# Altium schematic sheet PAGE1.SchDoc: UMCA
size 420 x 297 mm; Page Create Date: March  8, 1995; Page Number: 1; Page Size: A; Comment: TitleBlock0; Page Count: 1; RevCode: A; Doc: 0.1; DsnPath: D:\Projects\ProjectScience\electronics\ProjectID_DOSTI_STLINK\STLINK.DSN; SchematicName: SCHEMATIC1; PageName: PAGE1; PageSize: A3; TopSchematic: True
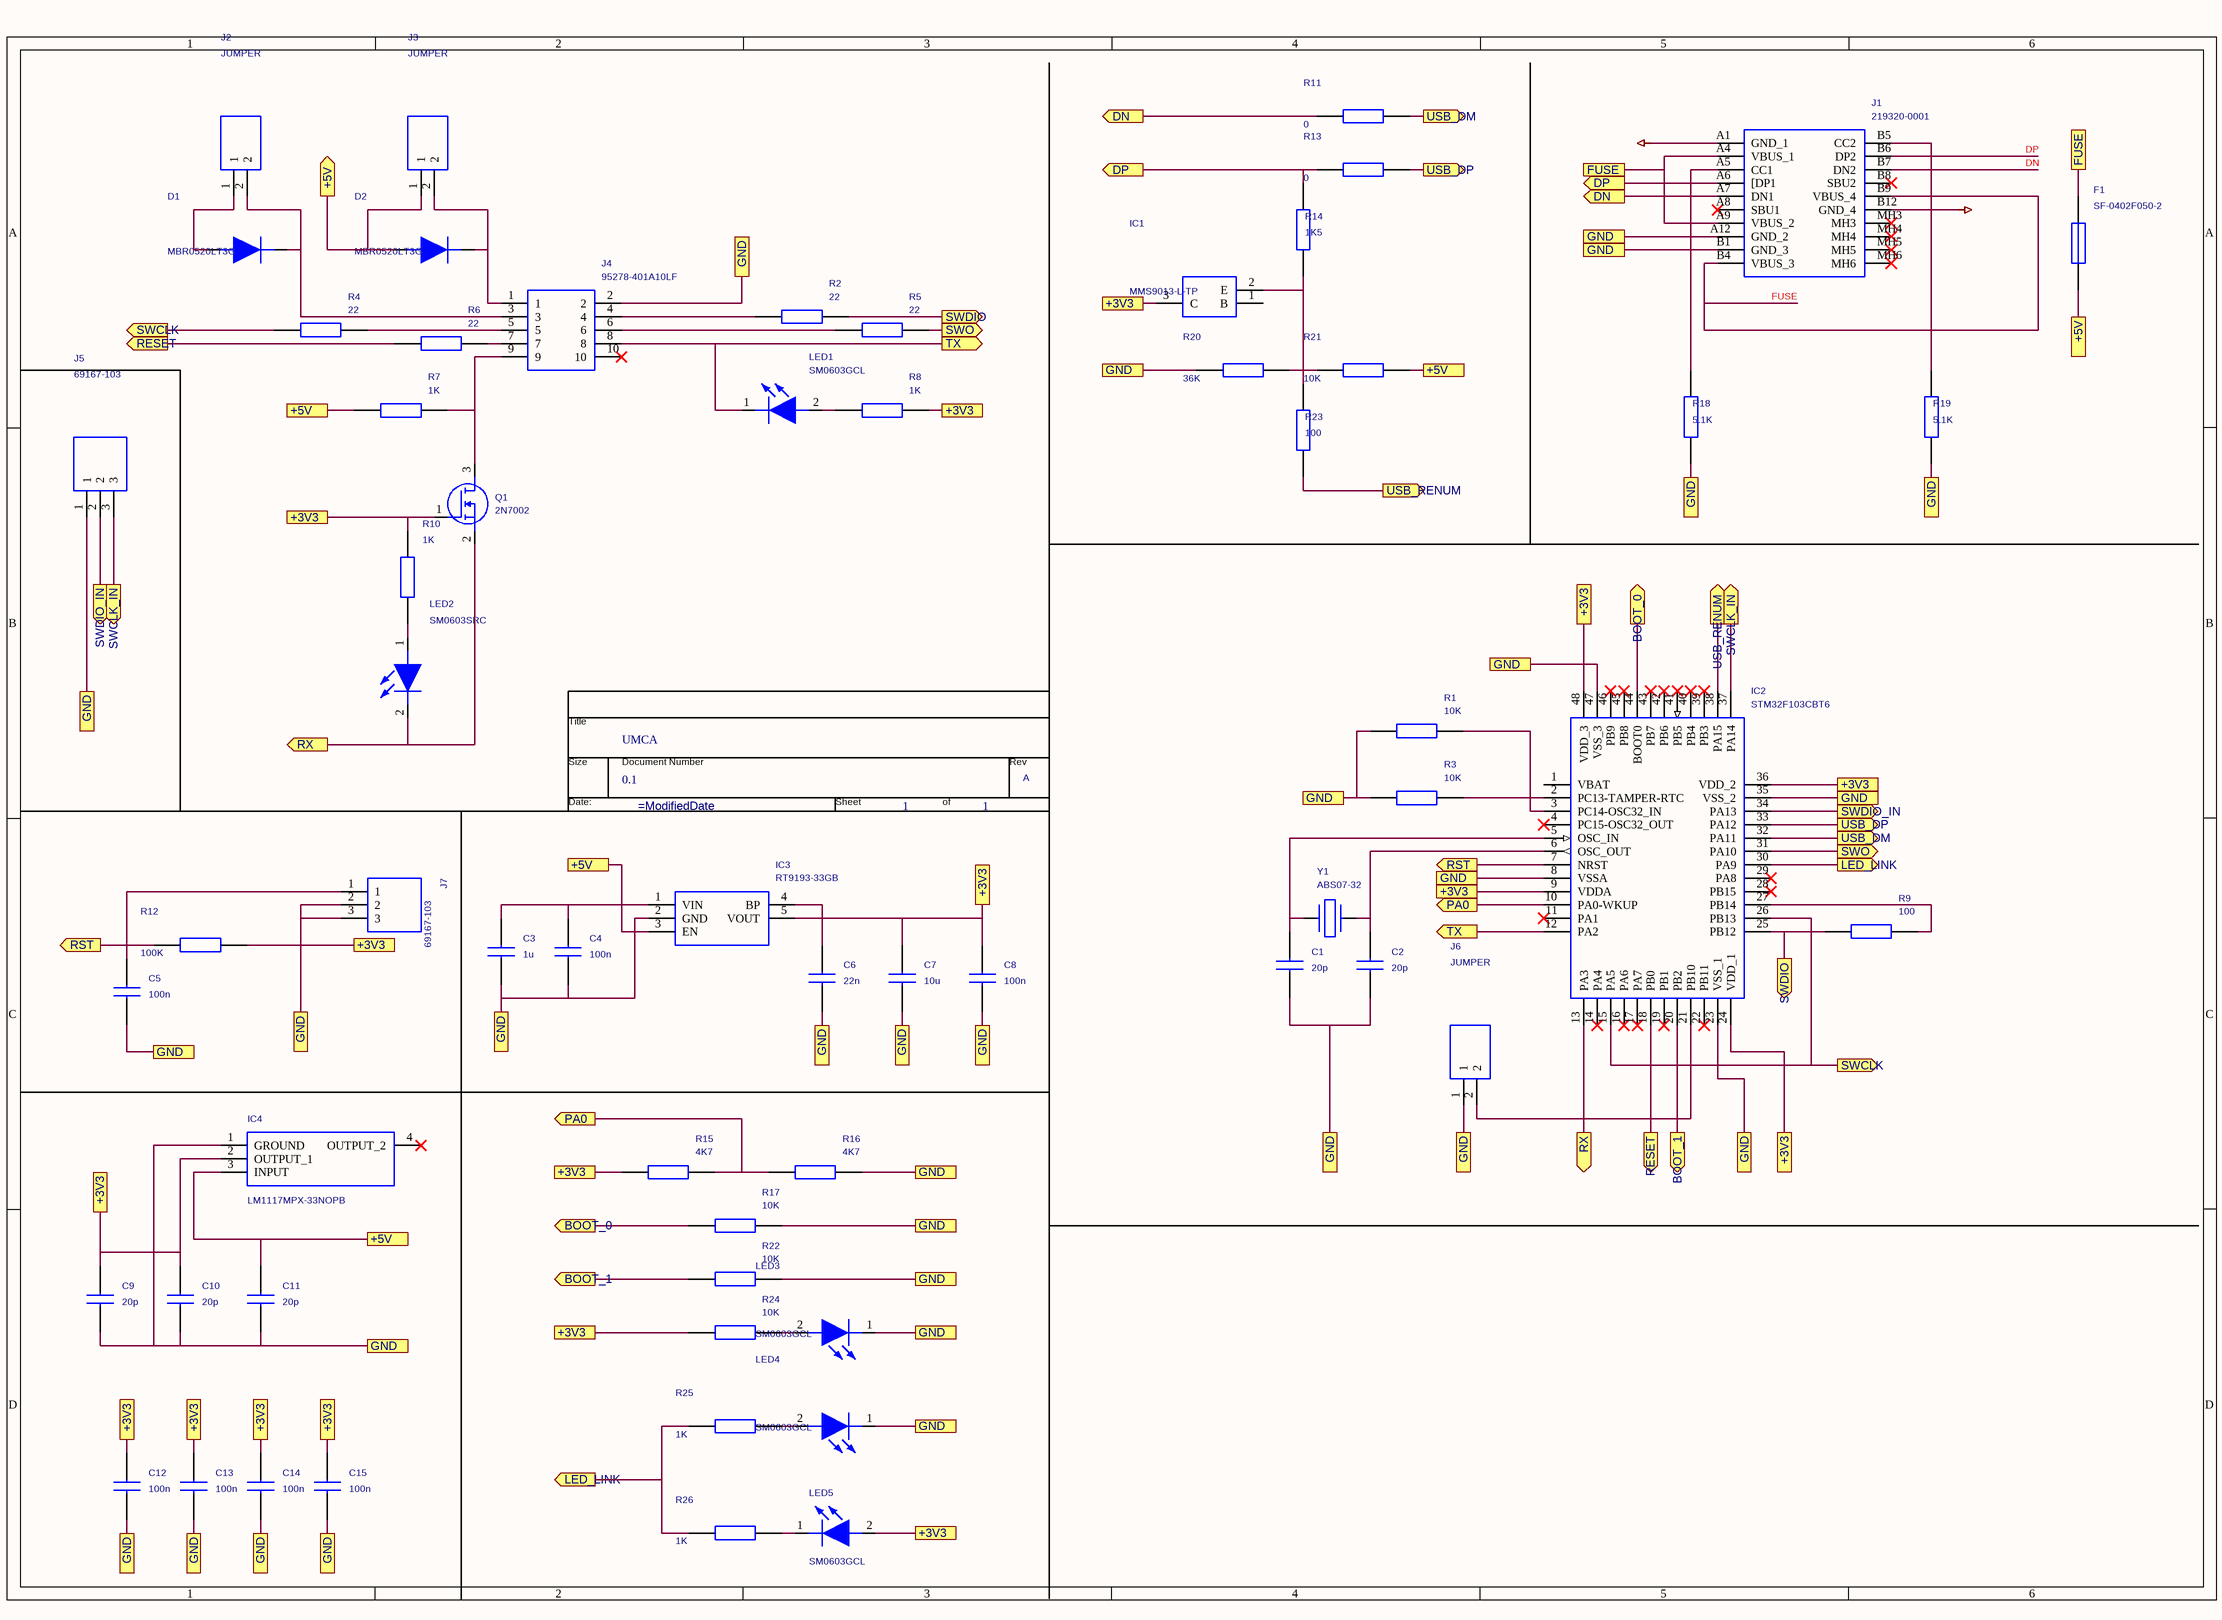
[diagram p0: PAGE1.SchDoc]

## Parts
*  Doc: 0.1  RevCode: A  Title: UMCA  Page Number: 1  (hidden comment: TitleBlock0)  (graphical)
C1  20p  [CAPC0603X33N]
C2  20p  [CAPC0603X33N]
C3  1u  [CAPC0603X33N]
C4  100n  [CAPC0603X33N]
C5  100n  [CAPC0603X33N]
C6  22n  [CAPC0603X33N]
C7  10u  [CAPC0603X33N]
C8  100n  [CAPC0603X33N]
C9  20p  [CAPC0603X33N]
C10  20p  [CAPC0603X33N]
C11  20p  [CAPC0603X33N]
C12  100n  [CAPC0603X33N]
C13  100n  [CAPC0603X33N]
C14  100n  [CAPC0603X33N]
C15  100n  [CAPC0603X33N]
D1  MBR0520LT3G  [SOD3716X135N]
D2  MBR0520LT3G  [SOD3716X135N]
F1  SF-0402F050-2  [FUSC1005X40N]
IC1  MMS9013-L-TP  [SOT95P237X125-3N]
IC2  STM32F103CBT6  [QFP50P900X900X160-48N]
IC3  RT9193-33GB  [SOT94P279X130-5N]
IC4  LM1117MPX-33NOPB  [SOT230P700X180-4N]
J1  219320-0001  [2193200001]
J2  JUMPER  [HDRV2W67P254_2X1_254X483X858P]
J3  JUMPER  [HDRV2W67P254_2X1_254X483X858P]
J4  95278-401A10LF  [95278401A10LF]
J5  69167-103  [SHDR3W64P0X254_1X3_762X516X980P]
J6  JUMPER  [HDRV2W67P254_2X1_254X483X858P]
J7  69167-103  [SHDR3W64P0X254_1X3_762X516X980P]
LED1  SM0603GCL  [LEDC1608X60N]
LED2  SM0603SRC  [SM0603SRC]
LED3  SM0603GCL  [LEDC1608X60N]
LED4  SM0603GCL  [LEDC1608X60N]
LED5  SM0603GCL  [LEDC1608X60N]
Q1  2N7002  [SOT96P240X120-3N]
R1  10K  [RESC1608X55N]
R2  22  [RESC1608X55N]
R3  10K  [RESC1608X55N]
R4  22  [RESC1608X55N]
R5  22  [RESC1608X55N]
R6  22  [RESC1608X55N]
R7  1K  [RESC1608X55N]
R8  1K  [RESC1608X55N]
R9  100  [RESC1608X55N]
R10  1K  [RESC1608X55N]
R11  0  [RESC1608X55N]
R12  100K  [RESC1608X55N]
R13  0  [RESC1608X55N]
R14  1K5  [RESC1608X55N]
R15  4K7  [RESC1608X55N]
R16  4K7  [RESC1608X55N]
R17  10K  [RESC1608X55N]
R18  5.1K  [RESC1608X55N]
R19  5.1K  [RESC1608X55N]
R20  36K  [RESC1608X55N]
R21  10K  [RESC1608X55N]
R22  10K  [RESC1608X55N]
R23  100  [RESC1608X55N]
R24  10K  [RESC1608X55N]
R25  1K  [RESC1608X55N]
R26  1K  [RESC1608X55N]
Y1  ABS07-32  [ABS07]

## Ports
+3V3, +5V, +5V (out), BOOT_0 (out), BOOT_1 (out), DN (out), DP (out), FUSE, GND, LED_LINK (out), PA0 (out), RESET (out), RST (out), RX (out), SWCLK (out), SWCLK_IN (out), SWDIO (out), SWDIO_IN (out), SWO (out), TX (out), USB_DM (out), USB_DP (out), USB_RENUM (out)

## Nets
0: J1.A1(GND_1) J1.B12(GND_4)
+3V3: C7.2 C8.2 C9.2 C10.2 C12.2 C13.2 C14.2 C15.2 IC1.3(C) IC2.9(VDDA) IC2.24(VDD_1) IC2.36(VDD_2) IC2.48(VDD_3) IC3.5(VOUT) IC4.2(OUTPUT_1) LED5.2(A) Q1.1(G) R8.2 R10.2 R12.1 R15.1 R24.1 ; port +3V3
+5V: C11.2 D2.2(A) F1.1 IC3.3(EN) IC4.3(INPUT) J3.1 R7.1 R21.1 ; port +5V
BOOT_0: IC2.44(BOOT0) R17.1 ; port BOOT_0
BOOT_1: IC2.20(PB2) R22.1 ; port BOOT_1
DN: J1.A7(DN1) R11.2 ; port DN
DN: J1.B7(DN2)  [a separate net that carries the same name]
DP: J1.A6([DP1) R13.2 R14.1 ; port DP
DP: J1.B6(DP2)  [a separate net that carries the same name]
FUSE: F1.2 J1.A4(VBUS_1) J1.A9(VBUS_2) ; port FUSE
FUSE: J1.B4(VBUS_3) J1.B9(VBUS_4)  [a separate net that carries the same name]
GND: C1.1 C2.1 C3.1 C4.1 C5.1 C6.1 C7.1 C8.1 C9.1 C10.1 C11.1 C12.1 C13.1 C14.1 C15.1 IC2.8(VSSA) IC2.23(VSS_1) IC2.35(VSS_2) IC2.47(VSS_3) IC3.2(GND) IC4.1(GROUND) J1.A12(GND_2) J1.B1(GND_3) J4.2 J5.1 J6.1 J7.2 J7.3 LED3.1(K) LED4.1(K) R1.1 R3.1 R16.2 R17.2 R18.2 R19.2 R20.2 R22.2 ; port GND
LED_LINK: IC2.30(PA9) R25.2 R26.2 ; port LED_LINK
PA0: IC2.10(PA0-WKUP) R15.2 R16.1 ; port PA0
RESET: IC2.18(PB0) R6.1 ; port RESET
RST: C5.2 IC2.7(NRST) J7.1 R12.2 ; port RST
RX: IC2.13(PA3) LED2.2(K) Q1.2(S) ; port RX
SWCLK: IC2.15(PA5) IC2.26(PB13) R4.1 ; port SWCLK
SWCLK_IN: IC2.37(PA14) J5.3 ; port SWCLK_IN
SWDIO: IC2.25(PB12) R2.2 R9.1 ; port SWDIO
SWDIO_IN: IC2.34(PA13) J5.2 ; port SWDIO_IN
SWO: IC2.31(PA10) R5.2 ; port SWO
TX: IC2.12(PA2) J4.8 LED1.1(K) ; port TX
USB_DM: IC2.32(PA11) R11.1 ; port USB_DM
USB_DP: IC2.33(PA12) R13.1 ; port USB_DP
USB_RENUM: IC2.38(PA15) R23.2 ; port USB_RENUM
NetC1_2: C1.2 IC2.5(OSC_IN) Y1.1
NetC2_2: C2.2 IC2.6(OSC_OUT) Y1.2
NetC3_2: C3.2 C4.2 IC3.1(VIN)
NetC6_2: C6.2 IC3.4(BP)
NetD1_1: D1.1(K) J2.2 J4.3
NetD1_2: D1.2(A) J2.1
NetD2_1: D2.1(K) J3.2 J4.1
NetIC1_2: IC1.2(E) R14.2 R20.1 R21.2 R23.1
NetIC2_2: IC2.2(PC13-TAMPER-RTC) R3.2
NetIC2_3: IC2.3(PC14-OSC32_IN) R1.2
NetIC2_21: IC2.21(PB10) J6.2
NetIC2_27: IC2.27(PB14) R9.2
NetJ1_A5: J1.A5(CC1) R18.1
NetJ1_B5: J1.B5(CC2) R19.1
NetJ4_4: J4.4 R2.1
NetJ4_5: J4.5 R4.2
NetJ4_6: J4.6 R5.1
NetJ4_7: J4.7 R6.2
NetJ4_9: J4.9 Q1.3(D) R7.2
NetLED1_2: LED1.2(A) R8.1
NetLED2_1: LED2.1(A) R10.1
NetLED3_2: LED3.2(A) R24.2
NetLED4_2: LED4.2(A) R25.1
NetLED5_1: LED5.1(K) R26.1

Not connected (* = marked no-connect by the designer): IC1 1(B); IC2 1(VBAT) 4(PC15-OSC32_OUT)* 11(PA1)* 14(PA4)* 16(PA6)* 17(PA7)* 19(PB1)* 22(PB11)* 28(PB15)* 29(PA8)* 39(PB3)* 40(PB4)* 41(PB5)* 42(PB6)* 43(PB7)* 45(PB8)* 46(PB9)*; IC4 4(OUTPUT_2)*; J1 A8(SBU1)* B8(SBU2)* MH3* MH4* MH5* MH6*; J4 10*

## Notes on the sheet
- (in symbol TitleBlock0) Title; Size; Document Number; Rev; Date:; Sheet; of

## Library data of the parts
C1 = GRM033D70E105ME15D: Capacitor GRM03_0.09 L=0.6mm W=0.3mm T=0.3mm; Manufacturer_Name: Murata Electronics; Part Reference: C1; Height: 0.33 mm; Datasheet Link: http://www.murata.com/~/media/webrenewal/support/library/catalog/products/capacitor/mlcc/c02e.pdf; Manufacturer_Part_Number: GRM033D70E105ME15D; Mouser Price/Stock: https://www.mouser.co.uk/ProductDetail/Murata-Electronics/GRM033D70E105ME15D?qs=r5DSvlrkXmLLNF3ZiIF79w%3D%3D; Mouser Part Number: 81-GRM033D70E105ME5D; Value: 20p; PCB Footprint: CAPC0603X33N
C2 = GRM033D70E105ME15D: Capacitor GRM03_0.09 L=0.6mm W=0.3mm T=0.3mm; Manufacturer_Name: Murata Electronics; Part Reference: C2; Height: 0.33 mm; Datasheet Link: http://www.murata.com/~/media/webrenewal/support/library/catalog/products/capacitor/mlcc/c02e.pdf; Manufacturer_Part_Number: GRM033D70E105ME15D; Mouser Price/Stock: https://www.mouser.co.uk/ProductDetail/Murata-Electronics/GRM033D70E105ME15D?qs=r5DSvlrkXmLLNF3ZiIF79w%3D%3D; Mouser Part Number: 81-GRM033D70E105ME5D; Value: 20p; PCB Footprint: CAPC0603X33N
C3 = GRM033D70E105ME15D: Capacitor GRM03_0.09 L=0.6mm W=0.3mm T=0.3mm; Manufacturer_Name: Murata Electronics; Part Reference: C3; Height: 0.33 mm; Datasheet Link: http://www.murata.com/~/media/webrenewal/support/library/catalog/products/capacitor/mlcc/c02e.pdf; Manufacturer_Part_Number: GRM033D70E105ME15D; Mouser Price/Stock: https://www.mouser.co.uk/ProductDetail/Murata-Electronics/GRM033D70E105ME15D?qs=r5DSvlrkXmLLNF3ZiIF79w%3D%3D; Mouser Part Number: 81-GRM033D70E105ME5D; Value: 1u; PCB Footprint: CAPC0603X33N
C4 = GRM033D70E105ME15D: Capacitor GRM03_0.09 L=0.6mm W=0.3mm T=0.3mm; Manufacturer_Name: Murata Electronics; Part Reference: C4; Height: 0.33 mm; Datasheet Link: http://www.murata.com/~/media/webrenewal/support/library/catalog/products/capacitor/mlcc/c02e.pdf; Manufacturer_Part_Number: GRM033D70E105ME15D; Mouser Price/Stock: https://www.mouser.co.uk/ProductDetail/Murata-Electronics/GRM033D70E105ME15D?qs=r5DSvlrkXmLLNF3ZiIF79w%3D%3D; Mouser Part Number: 81-GRM033D70E105ME5D; Value: 100n; PCB Footprint: CAPC0603X33N
C5 = GRM033D70E105ME15D: Capacitor GRM03_0.09 L=0.6mm W=0.3mm T=0.3mm; Manufacturer_Name: Murata Electronics; Part Reference: C5; Height: 0.33 mm; Datasheet Link: http://www.murata.com/~/media/webrenewal/support/library/catalog/products/capacitor/mlcc/c02e.pdf; Manufacturer_Part_Number: GRM033D70E105ME15D; Mouser Price/Stock: https://www.mouser.co.uk/ProductDetail/Murata-Electronics/GRM033D70E105ME15D?qs=r5DSvlrkXmLLNF3ZiIF79w%3D%3D; Mouser Part Number: 81-GRM033D70E105ME5D; Value: 100n; PCB Footprint: CAPC0603X33N
C6 = GRM033D70E105ME15D: Capacitor GRM03_0.09 L=0.6mm W=0.3mm T=0.3mm; Manufacturer_Name: Murata Electronics; Part Reference: C6; Height: 0.33 mm; Datasheet Link: http://www.murata.com/~/media/webrenewal/support/library/catalog/products/capacitor/mlcc/c02e.pdf; Manufacturer_Part_Number: GRM033D70E105ME15D; Mouser Price/Stock: https://www.mouser.co.uk/ProductDetail/Murata-Electronics/GRM033D70E105ME15D?qs=r5DSvlrkXmLLNF3ZiIF79w%3D%3D; Mouser Part Number: 81-GRM033D70E105ME5D; Value: 22n; PCB Footprint: CAPC0603X33N
C7 = GRM033D70E105ME15D: Capacitor GRM03_0.09 L=0.6mm W=0.3mm T=0.3mm; Manufacturer_Name: Murata Electronics; Part Reference: C7; Height: 0.33 mm; Datasheet Link: http://www.murata.com/~/media/webrenewal/support/library/catalog/products/capacitor/mlcc/c02e.pdf; Manufacturer_Part_Number: GRM033D70E105ME15D; Mouser Price/Stock: https://www.mouser.co.uk/ProductDetail/Murata-Electronics/GRM033D70E105ME15D?qs=r5DSvlrkXmLLNF3ZiIF79w%3D%3D; Mouser Part Number: 81-GRM033D70E105ME5D; Value: 10u; PCB Footprint: CAPC0603X33N
C8 = GRM033D70E105ME15D: Capacitor GRM03_0.09 L=0.6mm W=0.3mm T=0.3mm; Manufacturer_Name: Murata Electronics; Part Reference: C8; Height: 0.33 mm; Datasheet Link: http://www.murata.com/~/media/webrenewal/support/library/catalog/products/capacitor/mlcc/c02e.pdf; Manufacturer_Part_Number: GRM033D70E105ME15D; Mouser Price/Stock: https://www.mouser.co.uk/ProductDetail/Murata-Electronics/GRM033D70E105ME15D?qs=r5DSvlrkXmLLNF3ZiIF79w%3D%3D; Mouser Part Number: 81-GRM033D70E105ME5D; Value: 100n; PCB Footprint: CAPC0603X33N
C9 = GRM033D70E105ME15D: Capacitor GRM03_0.09 L=0.6mm W=0.3mm T=0.3mm; Manufacturer_Name: Murata Electronics; Part Reference: C9; Height: 0.33 mm; Datasheet Link: http://www.murata.com/~/media/webrenewal/support/library/catalog/products/capacitor/mlcc/c02e.pdf; Manufacturer_Part_Number: GRM033D70E105ME15D; Mouser Price/Stock: https://www.mouser.co.uk/ProductDetail/Murata-Electronics/GRM033D70E105ME15D?qs=r5DSvlrkXmLLNF3ZiIF79w%3D%3D; Mouser Part Number: 81-GRM033D70E105ME5D; Value: 20p; PCB Footprint: CAPC0603X33N
C10 = GRM033D70E105ME15D: Capacitor GRM03_0.09 L=0.6mm W=0.3mm T=0.3mm; Manufacturer_Name: Murata Electronics; Part Reference: C10; Height: 0.33 mm; Datasheet Link: http://www.murata.com/~/media/webrenewal/support/library/catalog/products/capacitor/mlcc/c02e.pdf; Manufacturer_Part_Number: GRM033D70E105ME15D; Mouser Price/Stock: https://www.mouser.co.uk/ProductDetail/Murata-Electronics/GRM033D70E105ME15D?qs=r5DSvlrkXmLLNF3ZiIF79w%3D%3D; Mouser Part Number: 81-GRM033D70E105ME5D; Value: 20p; PCB Footprint: CAPC0603X33N
C11 = GRM033D70E105ME15D: Capacitor GRM03_0.09 L=0.6mm W=0.3mm T=0.3mm; Manufacturer_Name: Murata Electronics; Part Reference: C11; Height: 0.33 mm; Datasheet Link: http://www.murata.com/~/media/webrenewal/support/library/catalog/products/capacitor/mlcc/c02e.pdf; Manufacturer_Part_Number: GRM033D70E105ME15D; Mouser Price/Stock: https://www.mouser.co.uk/ProductDetail/Murata-Electronics/GRM033D70E105ME15D?qs=r5DSvlrkXmLLNF3ZiIF79w%3D%3D; Mouser Part Number: 81-GRM033D70E105ME5D; Value: 20p; PCB Footprint: CAPC0603X33N
C12 = GRM033D70E105ME15D: Capacitor GRM03_0.09 L=0.6mm W=0.3mm T=0.3mm; Manufacturer_Name: Murata Electronics; Part Reference: C12; Height: 0.33 mm; Datasheet Link: http://www.murata.com/~/media/webrenewal/support/library/catalog/products/capacitor/mlcc/c02e.pdf; Manufacturer_Part_Number: GRM033D70E105ME15D; Mouser Price/Stock: https://www.mouser.co.uk/ProductDetail/Murata-Electronics/GRM033D70E105ME15D?qs=r5DSvlrkXmLLNF3ZiIF79w%3D%3D; Mouser Part Number: 81-GRM033D70E105ME5D; Value: 100n; PCB Footprint: CAPC0603X33N
C13 = GRM033D70E105ME15D: Capacitor GRM03_0.09 L=0.6mm W=0.3mm T=0.3mm; Manufacturer_Name: Murata Electronics; Part Reference: C13; Height: 0.33 mm; Datasheet Link: http://www.murata.com/~/media/webrenewal/support/library/catalog/products/capacitor/mlcc/c02e.pdf; Manufacturer_Part_Number: GRM033D70E105ME15D; Mouser Price/Stock: https://www.mouser.co.uk/ProductDetail/Murata-Electronics/GRM033D70E105ME15D?qs=r5DSvlrkXmLLNF3ZiIF79w%3D%3D; Mouser Part Number: 81-GRM033D70E105ME5D; Value: 100n; PCB Footprint: CAPC0603X33N
C14 = GRM033D70E105ME15D: Capacitor GRM03_0.09 L=0.6mm W=0.3mm T=0.3mm; Manufacturer_Name: Murata Electronics; Part Reference: C14; Height: 0.33 mm; Datasheet Link: http://www.murata.com/~/media/webrenewal/support/library/catalog/products/capacitor/mlcc/c02e.pdf; Manufacturer_Part_Number: GRM033D70E105ME15D; Mouser Price/Stock: https://www.mouser.co.uk/ProductDetail/Murata-Electronics/GRM033D70E105ME15D?qs=r5DSvlrkXmLLNF3ZiIF79w%3D%3D; Mouser Part Number: 81-GRM033D70E105ME5D; Value: 100n; PCB Footprint: CAPC0603X33N
C15 = GRM033D70E105ME15D: Capacitor GRM03_0.09 L=0.6mm W=0.3mm T=0.3mm; Manufacturer_Name: Murata Electronics; Part Reference: C15; Height: 0.33 mm; Datasheet Link: http://www.murata.com/~/media/webrenewal/support/library/catalog/products/capacitor/mlcc/c02e.pdf; Manufacturer_Part_Number: GRM033D70E105ME15D; Mouser Price/Stock: https://www.mouser.co.uk/ProductDetail/Murata-Electronics/GRM033D70E105ME15D?qs=r5DSvlrkXmLLNF3ZiIF79w%3D%3D; Mouser Part Number: 81-GRM033D70E105ME5D; Value: 100n; PCB Footprint: CAPC0603X33N
D1 = MBR0520LT3G: ON SEMICONDUCTOR - MBR0520LT3G - RECTIFIER, SCHOTTKY, 0.5A, 20V, SOD-123; Manufacturer_Name: onsemi; Part Reference: D1; Height: 1.35 mm; Datasheet Link: http://www.onsemi.com/pub/Collateral/MBR0520LT1-D.PDF; Manufacturer_Part_Number: MBR0520LT3G; Mouser Price/Stock: https://www.mouser.co.uk/ProductDetail/onsemi/MBR0520LT3G?qs=3JMERSakebrHITezQJBmeQ%3D%3D; Mouser Part Number: 863-MBR0520LT3G; Value: MBR0520LT3G; PCB Footprint: SOD3716X135N
D2 = MBR0520LT3G: ON SEMICONDUCTOR - MBR0520LT3G - RECTIFIER, SCHOTTKY, 0.5A, 20V, SOD-123; Manufacturer_Name: onsemi; Part Reference: D2; Height: 1.35 mm; Datasheet Link: http://www.onsemi.com/pub/Collateral/MBR0520LT1-D.PDF; Manufacturer_Part_Number: MBR0520LT3G; Mouser Price/Stock: https://www.mouser.co.uk/ProductDetail/onsemi/MBR0520LT3G?qs=3JMERSakebrHITezQJBmeQ%3D%3D; Mouser Part Number: 863-MBR0520LT3G; Value: MBR0520LT3G; PCB Footprint: SOD3716X135N
F1 = SF-0402F050-2: Fuse Chip Fast Acting 0.5A 24V SMD Solder Pad 0402 T/R UL; Manufacturer_Name: Bourns; Part Reference: F1; Height: 0.4 mm; Datasheet Link: https://datasheet.datasheetarchive.com/originals/distributors/Datasheets-DGA13/1256866.pdf; Manufacturer_Part_Number: SF-0402F050-2; Mouser Price/Stock: https://www.mouser.co.uk/ProductDetail/Bourns/SF-0402F050-2?qs=GIQXYiEeHGDsZgBRav%2Fjqg%3D%3D; Mouser Part Number: 652-SF-0402F050-2; Value: SF-0402F050-2; PCB Footprint: FUSC1005X40N
IC1 = MMS9013-L-TP: Small Signal Bipolar Transistors; Manufacturer_Name: MCC; Part Reference: IC1; Height: 1.25 mm; Datasheet Link: https://mccsemi.com/pdf/Products/MMS9013(SOT-23).pdf; Manufacturer_Part_Number: MMS9013-L-TP; Mouser Price/Stock: https://www.mouser.co.uk/ProductDetail/Micro-Commercial-Components-MCC/MMS9013-L-TP?qs=P1JMDcb91o6OmgJiBYj6kQ%3D%3D; Mouser Part Number: 833-MMS9013L-TP; Value: MMS9013-L-TP; PCB Footprint: SOT95P237X125-3N
IC2 = STM32F103CBT6: STM32F103CBT6, 32 bit ARM Cortex M3 , 72MHz, 128 kB ROM , 20 kB RAM USB CAN I2C, 48 LQFP; Manufacturer_Name: STMicroelectronics; Part Reference: IC2; VDD_MIN: -0.3; VDD_MAX: 4; ICC: 150m; IOUT_MIN: 25m; RJA: 55; SUBTYPE: MCU SMD; POWER: 363m; TJ: 150; TECHNOLOGY: CMOS_TTL; IOUT_MAX: 25m; PACKAGE: LQFP-48; Height: 1.6 mm; Datasheet Link: http://www.st.com/st-web-ui/static/active/en/resource/technical/document/datasheet/CD00161566.pdf; Manufacturer_Part_Number: STM32F103CBT6; Mouser Price/Stock: https://www.mouser.co.uk/ProductDetail/STMicroelectronics/STM32F103CBT6?qs=WxFF5lh7QM3goh6GV5Ogig%3D%3D; Mouser Part Number: 511-STM32F103CBT6; Value: STM32F103CBT6; PCB Footprint: QFP50P900X900X160-48N
IC3 = RT9193-33GB: 300mA, Ultra-Low Noise, Ultra-Fast CMOS LDO Regulator; Manufacturer_Name: RICHTEK; Part Reference: IC3; Height: 1.295 mm; Datasheet Link: http://www.richtek.com/assets/product_file/RT9193/DS9193-17.pdf; Manufacturer_Part_Number: RT9193-33GB; Mouser Price/Stock: https://www.mouser.co.uk/ProductDetail/Richtek/RT9193-33GB?qs=amGC7iS6iy8ybRcZ9Wn2ww%3D%3D; Mouser Part Number: 835-RT9193-33GB; Value: RT9193-33GB; PCB Footprint: SOT94P279X130-5N
IC4 = LM1117MPX-33NOPB: LDO Voltage Regulators 800-mA 15-V linear voltage regulator 800-mA 15-V linear voltage regulator; Manufacturer_Name: onsemi; Part Reference: IC4; Height: 1.8 mm; Datasheet Link: https://www.arrow.com/en/products/lm1117mpx-33nopb/on-semiconductor; Manufacturer_Part_Number: LM1117MPX-33NOPB; Mouser Price/Stock: https://www.mouser.co.uk/ProductDetail/onsemi/LM1117MPX-33NOPB?qs=DPoM0jnrROUIbzbQHFmeig%3D%3D; Mouser Part Number: 863-LM1117MPX-33NOPB; Value: LM1117MPX-33NOPB; PCB Footprint: SOT230P700X180-4N
J1 = 219320-0001: Universal Serial Bus (USB) Shielded I/O Receptacle, Type C, Vertical, Surface Mount, Height 8.8mm, 16 Circuits, Gold (Au) Flash Plating; Manufacturer_Name: Molex; Part Reference: J1; Height: 9.05 mm; Datasheet Link: https://www.molex.com/content/dam/molex/molex-dot-com/products/automated/en-us/salesdrawingpdf/219/219320/2193200001_sd.pdf?inline; Manufacturer_Part_Number: 219320-0001; Mouser Price/Stock: https://www.mouser.co.uk/ProductDetail/Molex/219320-0001?qs=rQFj71Wb1eXha8qVBIXu3A%3D%3D; Mouser Part Number: 538-219320-0001; Value: 219320-0001; PCB Footprint: 2193200001
J2 = 67996-100HLF: BergStik<sup>&reg;</sup>, Board to Board connector, Unshrouded vertical header, Through Hole, Double Row, 0 Positions, 2.54 mm (0.100in) Pitch; Manufacturer_Name: Amphenol Communications Solutions; Part Reference: J2; Height: 8.58 mm; Datasheet Link: https://cdn.amphenol-cs.com/media/wysiwyg/files/drawing/67996.pdf; Manufacturer_Part_Number: 67996-100HLF; Value: JUMPER; PCB Footprint: HDRV2W67P254_2X1_254X483X858P
J3 = 67996-100HLF: BergStik<sup>&reg;</sup>, Board to Board connector, Unshrouded vertical header, Through Hole, Double Row, 0 Positions, 2.54 mm (0.100in) Pitch; Manufacturer_Name: Amphenol Communications Solutions; Part Reference: J3; Height: 8.58 mm; Datasheet Link: https://cdn.amphenol-cs.com/media/wysiwyg/files/drawing/67996.pdf; Manufacturer_Part_Number: 67996-100HLF; Value: JUMPER; PCB Footprint: HDRV2W67P254_2X1_254X483X858P
J4 = 95278-401A10LF: BergStik, Board to Board connector, Unshrouded Header, SMT, Double Row, 10 Positions, 2.54 mm Pitch, Vertical, Tin plating, 5.84 mm (0.23 in.) Mating; Manufacturer_Name: Amphenol Communications Solutions; Part Reference: J4; Height: 10 mm; Datasheet Link: https://cdn.amphenol-cs.com/media/wysiwyg/files/drawing/95278.pdf; Manufacturer_Part_Number: 95278-401A10LF; Value: 95278-401A10LF; PCB Footprint: 95278401A10LF
J5 = 69167-103: PV<sup>&reg;</sup>Wire-to-Board Connector System, 2 Wall Shrouded vertical header - Through Hole - Single row - 3 Positions, 2.54mm (0.100in) pitch.; Manufacturer_Name: Amphenol Communications Solutions; Part Reference: J5; Height: 9.8 mm; Datasheet Link: https://cdn.amphenol-cs.com/media/wysiwyg/files/documentation/datasheet/boardwiretoboard/bwb_pv_wtb.pdf; Manufacturer_Part_Number: 69167-103; Mouser Price/Stock: https://www.mouser.co.uk/ProductDetail/Amphenol-FCI/69167-103?qs=4hg9R9g9MDsUjrzjhCmuRA%3D%3D; Mouser Part Number: 649-69167-103; Value: 69167-103; PCB Footprint: SHDR3W64P0X254_1X3_762X516X980P
J6 = 67996-100HLF: BergStik<sup>&reg;</sup>, Board to Board connector, Unshrouded vertical header, Through Hole, Double Row, 0 Positions, 2.54 mm (0.100in) Pitch; Manufacturer_Name: Amphenol Communications Solutions; Part Reference: J6; Height: 8.58 mm; Datasheet Link: https://cdn.amphenol-cs.com/media/wysiwyg/files/drawing/67996.pdf; Manufacturer_Part_Number: 67996-100HLF; Value: JUMPER; PCB Footprint: HDRV2W67P254_2X1_254X483X858P
J7 = 69167-103: PV<sup>&reg;</sup>Wire-to-Board Connector System, 2 Wall Shrouded vertical header - Through Hole - Single row - 3 Positions, 2.54mm (0.100in) pitch.; Manufacturer_Name: Amphenol Communications Solutions; Part Reference: J7; Height: 9.8 mm; Datasheet Link: https://cdn.amphenol-cs.com/media/wysiwyg/files/documentation/datasheet/boardwiretoboard/bwb_pv_wtb.pdf; Manufacturer_Part_Number: 69167-103; Mouser Price/Stock: https://www.mouser.co.uk/ProductDetail/Amphenol-FCI/69167-103?qs=4hg9R9g9MDsUjrzjhCmuRA%3D%3D; Mouser Part Number: 649-69167-103; Value: 69167-103; PCB Footprint: SHDR3W64P0X254_1X3_762X516X980P
LED1 = SM0603GCL: LED Uni-Color Green 575nm 2-Pin Chip 0603(1608Metric) T/R; Manufacturer_Name: Bivar; Part Reference: LED1; Height: 0.6 mm; Datasheet Link: https://www.mouser.ca/datasheet/2/50/SM0603GCL-3002107.pdf; Manufacturer_Part_Number: SM0603GCL; Mouser Price/Stock: https://www.mouser.co.uk/ProductDetail/Bivar/SM0603GCL?qs=jaLxTFIJCiusAuEoyf5wog%3D%3D; Mouser Part Number: 749-SM0603GCL; Value: SM0603GCL; PCB Footprint: LEDC1608X60N
LED2 = SM0603SRC: Standard LEDs - SMD Super Red 660nm Water Clear SURFACE MOUNT LED RED, 0603 PACKAGE; Manufacturer_Name: Bivar; Part Reference: LED2; Height: 0.8 mm; Datasheet Link: https://componentsearchengine.com/Datasheets/1/SM0603SRC.pdf; Manufacturer_Part_Number: SM0603SRC; Mouser Price/Stock: https://www.mouser.co.uk/ProductDetail/Bivar/SM0603SRC?qs=EYSZfI0QbkaJbRyUf4vVYw%3D%3D; Mouser Part Number: 749-SM0603SRC; Value: SM0603SRC; PCB Footprint: SM0603SRC
LED3 = SM0603GCL: LED Uni-Color Green 575nm 2-Pin Chip 0603(1608Metric) T/R; Manufacturer_Name: Bivar; Part Reference: LED3; Height: 0.6 mm; Datasheet Link: https://www.mouser.ca/datasheet/2/50/SM0603GCL-3002107.pdf; Manufacturer_Part_Number: SM0603GCL; Mouser Price/Stock: https://www.mouser.co.uk/ProductDetail/Bivar/SM0603GCL?qs=jaLxTFIJCiusAuEoyf5wog%3D%3D; Mouser Part Number: 749-SM0603GCL; Value: SM0603GCL; PCB Footprint: LEDC1608X60N
LED4 = SM0603GCL: LED Uni-Color Green 575nm 2-Pin Chip 0603(1608Metric) T/R; Manufacturer_Name: Bivar; Part Reference: LED4; Height: 0.6 mm; Datasheet Link: https://www.mouser.ca/datasheet/2/50/SM0603GCL-3002107.pdf; Manufacturer_Part_Number: SM0603GCL; Mouser Price/Stock: https://www.mouser.co.uk/ProductDetail/Bivar/SM0603GCL?qs=jaLxTFIJCiusAuEoyf5wog%3D%3D; Mouser Part Number: 749-SM0603GCL; Value: SM0603GCL; PCB Footprint: LEDC1608X60N
LED5 = SM0603GCL: LED Uni-Color Green 575nm 2-Pin Chip 0603(1608Metric) T/R; Manufacturer_Name: Bivar; Part Reference: LED5; Height: 0.6 mm; Datasheet Link: https://www.mouser.ca/datasheet/2/50/SM0603GCL-3002107.pdf; Manufacturer_Part_Number: SM0603GCL; Mouser Price/Stock: https://www.mouser.co.uk/ProductDetail/Bivar/SM0603GCL?qs=jaLxTFIJCiusAuEoyf5wog%3D%3D; Mouser Part Number: 749-SM0603GCL; Value: SM0603GCL; PCB Footprint: LEDC1608X60N
Q1 = 2N7002: N-channel MOSFET,2N7002 0.115A 60V; Manufacturer_Name: onsemi; Part Reference: Q1; IDM: 800m; RON: 7; VTH: 1.75; VGSR: 20; VDS: 60; ID: 115m; IG: 100n; RJA: 625; SUBTYPE: N CHANNEL ENHANCEMENT MOSFET SMD; SLOPE: 7.5; POWER: 200m; TJ: 150; VGSF: 20; PACKAGE: SOT-23 3L; Height: 1.2 mm; Datasheet Link: https://www.onsemi.com/pub/Collateral/NDS7002A-D.PDF; Manufacturer_Part_Number: 2N7002; Mouser Price/Stock: https://www.mouser.co.uk/ProductDetail/onsemi-Fairchild/2N7002?qs=0dwsXDNhqlz66WJJhrTFjQ%3D%3D; Mouser Part Number: 512-2N7002; Value: 2N7002; PCB Footprint: SOT96P240X120-3N
R1 = CR0603-F_-1R00ELF: Thick Film Resistors - SMD Res 0603 1R0 1% 100mW TCR200; Manufacturer_Part_Number: CR0603-F/-1R00ELF; Manufacturer_Name: Bourns; Part Reference: R1; Height: 0.55 mm; Datasheet Link: https://www.bourns.com/pdfs/chpreztr.pdf; Mouser Price/Stock: https://www.mouser.co.uk/ProductDetail/Bourns/CR0603-F-1R00ELF?qs=W%2FMpXkg%252BdQ7nBNmKZ%2F9sTA%3D%3D; Mouser Part Number: 652-CR0603-F/1R00ELF; Value: 10K; PCB Footprint: RESC1608X55N
R2 = CR0603-F_-1R00ELF: Thick Film Resistors - SMD Res 0603 1R0 1% 100mW TCR200; Manufacturer_Part_Number: CR0603-F/-1R00ELF; Manufacturer_Name: Bourns; Part Reference: R2; Height: 0.55 mm; Datasheet Link: https://www.bourns.com/pdfs/chpreztr.pdf; Mouser Price/Stock: https://www.mouser.co.uk/ProductDetail/Bourns/CR0603-F-1R00ELF?qs=W%2FMpXkg%252BdQ7nBNmKZ%2F9sTA%3D%3D; Mouser Part Number: 652-CR0603-F/1R00ELF; Value: 22; PCB Footprint: RESC1608X55N
R3 = CR0603-F_-1R00ELF: Thick Film Resistors - SMD Res 0603 1R0 1% 100mW TCR200; Manufacturer_Part_Number: CR0603-F/-1R00ELF; Manufacturer_Name: Bourns; Part Reference: R3; Height: 0.55 mm; Datasheet Link: https://www.bourns.com/pdfs/chpreztr.pdf; Mouser Price/Stock: https://www.mouser.co.uk/ProductDetail/Bourns/CR0603-F-1R00ELF?qs=W%2FMpXkg%252BdQ7nBNmKZ%2F9sTA%3D%3D; Mouser Part Number: 652-CR0603-F/1R00ELF; Value: 10K; PCB Footprint: RESC1608X55N
R4 = CR0603-F_-1R00ELF: Thick Film Resistors - SMD Res 0603 1R0 1% 100mW TCR200; Manufacturer_Part_Number: CR0603-F/-1R00ELF; Manufacturer_Name: Bourns; Part Reference: R4; Height: 0.55 mm; Datasheet Link: https://www.bourns.com/pdfs/chpreztr.pdf; Mouser Price/Stock: https://www.mouser.co.uk/ProductDetail/Bourns/CR0603-F-1R00ELF?qs=W%2FMpXkg%252BdQ7nBNmKZ%2F9sTA%3D%3D; Mouser Part Number: 652-CR0603-F/1R00ELF; Value: 22; PCB Footprint: RESC1608X55N
R5 = CR0603-F_-1R00ELF: Thick Film Resistors - SMD Res 0603 1R0 1% 100mW TCR200; Manufacturer_Part_Number: CR0603-F/-1R00ELF; Manufacturer_Name: Bourns; Part Reference: R5; Height: 0.55 mm; Datasheet Link: https://www.bourns.com/pdfs/chpreztr.pdf; Mouser Price/Stock: https://www.mouser.co.uk/ProductDetail/Bourns/CR0603-F-1R00ELF?qs=W%2FMpXkg%252BdQ7nBNmKZ%2F9sTA%3D%3D; Mouser Part Number: 652-CR0603-F/1R00ELF; Value: 22; PCB Footprint: RESC1608X55N
R6 = CR0603-F_-1R00ELF: Thick Film Resistors - SMD Res 0603 1R0 1% 100mW TCR200; Manufacturer_Part_Number: CR0603-F/-1R00ELF; Manufacturer_Name: Bourns; Part Reference: R6; Height: 0.55 mm; Datasheet Link: https://www.bourns.com/pdfs/chpreztr.pdf; Mouser Price/Stock: https://www.mouser.co.uk/ProductDetail/Bourns/CR0603-F-1R00ELF?qs=W%2FMpXkg%252BdQ7nBNmKZ%2F9sTA%3D%3D; Mouser Part Number: 652-CR0603-F/1R00ELF; Value: 22; PCB Footprint: RESC1608X55N
R7 = CR0603-F_-1R00ELF: Thick Film Resistors - SMD Res 0603 1R0 1% 100mW TCR200; Manufacturer_Part_Number: CR0603-F/-1R00ELF; Manufacturer_Name: Bourns; Part Reference: R7; Height: 0.55 mm; Datasheet Link: https://www.bourns.com/pdfs/chpreztr.pdf; Mouser Price/Stock: https://www.mouser.co.uk/ProductDetail/Bourns/CR0603-F-1R00ELF?qs=W%2FMpXkg%252BdQ7nBNmKZ%2F9sTA%3D%3D; Mouser Part Number: 652-CR0603-F/1R00ELF; Value: 1K; PCB Footprint: RESC1608X55N
R8 = CR0603-F_-1R00ELF: Thick Film Resistors - SMD Res 0603 1R0 1% 100mW TCR200; Manufacturer_Part_Number: CR0603-F/-1R00ELF; Manufacturer_Name: Bourns; Part Reference: R8; Height: 0.55 mm; Datasheet Link: https://www.bourns.com/pdfs/chpreztr.pdf; Mouser Price/Stock: https://www.mouser.co.uk/ProductDetail/Bourns/CR0603-F-1R00ELF?qs=W%2FMpXkg%252BdQ7nBNmKZ%2F9sTA%3D%3D; Mouser Part Number: 652-CR0603-F/1R00ELF; Value: 1K; PCB Footprint: RESC1608X55N
R9 = CR0603-F_-1R00ELF: Thick Film Resistors - SMD Res 0603 1R0 1% 100mW TCR200; Manufacturer_Part_Number: CR0603-F/-1R00ELF; Manufacturer_Name: Bourns; Part Reference: R9; Height: 0.55 mm; Datasheet Link: https://www.bourns.com/pdfs/chpreztr.pdf; Mouser Price/Stock: https://www.mouser.co.uk/ProductDetail/Bourns/CR0603-F-1R00ELF?qs=W%2FMpXkg%252BdQ7nBNmKZ%2F9sTA%3D%3D; Mouser Part Number: 652-CR0603-F/1R00ELF; Value: 100; PCB Footprint: RESC1608X55N
R10 = CR0603-F_-1R00ELF: Thick Film Resistors - SMD Res 0603 1R0 1% 100mW TCR200; Manufacturer_Part_Number: CR0603-F/-1R00ELF; Manufacturer_Name: Bourns; Part Reference: R10; Height: 0.55 mm; Datasheet Link: https://www.bourns.com/pdfs/chpreztr.pdf; Mouser Price/Stock: https://www.mouser.co.uk/ProductDetail/Bourns/CR0603-F-1R00ELF?qs=W%2FMpXkg%252BdQ7nBNmKZ%2F9sTA%3D%3D; Mouser Part Number: 652-CR0603-F/1R00ELF; Value: 1K; PCB Footprint: RESC1608X55N
R11 = CR0603-F_-1R00ELF: Thick Film Resistors - SMD Res 0603 1R0 1% 100mW TCR200; Manufacturer_Part_Number: CR0603-F/-1R00ELF; Manufacturer_Name: Bourns; Part Reference: R11; Height: 0.55 mm; Datasheet Link: https://www.bourns.com/pdfs/chpreztr.pdf; Mouser Price/Stock: https://www.mouser.co.uk/ProductDetail/Bourns/CR0603-F-1R00ELF?qs=W%2FMpXkg%252BdQ7nBNmKZ%2F9sTA%3D%3D; Mouser Part Number: 652-CR0603-F/1R00ELF; Value: 0; PCB Footprint: RESC1608X55N
R12 = CR0603-F_-1R00ELF: Thick Film Resistors - SMD Res 0603 1R0 1% 100mW TCR200; Manufacturer_Part_Number: CR0603-F/-1R00ELF; Manufacturer_Name: Bourns; Part Reference: R12; Height: 0.55 mm; Datasheet Link: https://www.bourns.com/pdfs/chpreztr.pdf; Mouser Price/Stock: https://www.mouser.co.uk/ProductDetail/Bourns/CR0603-F-1R00ELF?qs=W%2FMpXkg%252BdQ7nBNmKZ%2F9sTA%3D%3D; Mouser Part Number: 652-CR0603-F/1R00ELF; Value: 100K; PCB Footprint: RESC1608X55N
R13 = CR0603-F_-1R00ELF: Thick Film Resistors - SMD Res 0603 1R0 1% 100mW TCR200; Manufacturer_Part_Number: CR0603-F/-1R00ELF; Manufacturer_Name: Bourns; Part Reference: R13; Height: 0.55 mm; Datasheet Link: https://www.bourns.com/pdfs/chpreztr.pdf; Mouser Price/Stock: https://www.mouser.co.uk/ProductDetail/Bourns/CR0603-F-1R00ELF?qs=W%2FMpXkg%252BdQ7nBNmKZ%2F9sTA%3D%3D; Mouser Part Number: 652-CR0603-F/1R00ELF; Value: 0; PCB Footprint: RESC1608X55N
R14 = CR0603-F_-1R00ELF: Thick Film Resistors - SMD Res 0603 1R0 1% 100mW TCR200; Manufacturer_Part_Number: CR0603-F/-1R00ELF; Manufacturer_Name: Bourns; Part Reference: R14; Height: 0.55 mm; Datasheet Link: https://www.bourns.com/pdfs/chpreztr.pdf; Mouser Price/Stock: https://www.mouser.co.uk/ProductDetail/Bourns/CR0603-F-1R00ELF?qs=W%2FMpXkg%252BdQ7nBNmKZ%2F9sTA%3D%3D; Mouser Part Number: 652-CR0603-F/1R00ELF; Value: 1K5; PCB Footprint: RESC1608X55N
R15 = CR0603-F_-1R00ELF: Thick Film Resistors - SMD Res 0603 1R0 1% 100mW TCR200; Manufacturer_Part_Number: CR0603-F/-1R00ELF; Manufacturer_Name: Bourns; Part Reference: R15; Height: 0.55 mm; Datasheet Link: https://www.bourns.com/pdfs/chpreztr.pdf; Mouser Price/Stock: https://www.mouser.co.uk/ProductDetail/Bourns/CR0603-F-1R00ELF?qs=W%2FMpXkg%252BdQ7nBNmKZ%2F9sTA%3D%3D; Mouser Part Number: 652-CR0603-F/1R00ELF; Value: 4K7; PCB Footprint: RESC1608X55N
R16 = CR0603-F_-1R00ELF: Thick Film Resistors - SMD Res 0603 1R0 1% 100mW TCR200; Manufacturer_Part_Number: CR0603-F/-1R00ELF; Manufacturer_Name: Bourns; Part Reference: R16; Height: 0.55 mm; Datasheet Link: https://www.bourns.com/pdfs/chpreztr.pdf; Mouser Price/Stock: https://www.mouser.co.uk/ProductDetail/Bourns/CR0603-F-1R00ELF?qs=W%2FMpXkg%252BdQ7nBNmKZ%2F9sTA%3D%3D; Mouser Part Number: 652-CR0603-F/1R00ELF; Value: 4K7; PCB Footprint: RESC1608X55N
R17 = CR0603-F_-1R00ELF: Thick Film Resistors - SMD Res 0603 1R0 1% 100mW TCR200; Manufacturer_Part_Number: CR0603-F/-1R00ELF; Manufacturer_Name: Bourns; Part Reference: R17; Height: 0.55 mm; Datasheet Link: https://www.bourns.com/pdfs/chpreztr.pdf; Mouser Price/Stock: https://www.mouser.co.uk/ProductDetail/Bourns/CR0603-F-1R00ELF?qs=W%2FMpXkg%252BdQ7nBNmKZ%2F9sTA%3D%3D; Mouser Part Number: 652-CR0603-F/1R00ELF; Value: 10K; PCB Footprint: RESC1608X55N
R18 = CR0603-F_-1R00ELF: Thick Film Resistors - SMD Res 0603 1R0 1% 100mW TCR200; Manufacturer_Part_Number: CR0603-F/-1R00ELF; Manufacturer_Name: Bourns; Part Reference: R18; Height: 0.55 mm; Datasheet Link: https://www.bourns.com/pdfs/chpreztr.pdf; Mouser Price/Stock: https://www.mouser.co.uk/ProductDetail/Bourns/CR0603-F-1R00ELF?qs=W%2FMpXkg%252BdQ7nBNmKZ%2F9sTA%3D%3D; Mouser Part Number: 652-CR0603-F/1R00ELF; Value: 5.1K; PCB Footprint: RESC1608X55N
R19 = CR0603-F_-1R00ELF: Thick Film Resistors - SMD Res 0603 1R0 1% 100mW TCR200; Manufacturer_Part_Number: CR0603-F/-1R00ELF; Manufacturer_Name: Bourns; Part Reference: R19; Height: 0.55 mm; Datasheet Link: https://www.bourns.com/pdfs/chpreztr.pdf; Mouser Price/Stock: https://www.mouser.co.uk/ProductDetail/Bourns/CR0603-F-1R00ELF?qs=W%2FMpXkg%252BdQ7nBNmKZ%2F9sTA%3D%3D; Mouser Part Number: 652-CR0603-F/1R00ELF; Value: 5.1K; PCB Footprint: RESC1608X55N
R20 = CR0603-F_-1R00ELF: Thick Film Resistors - SMD Res 0603 1R0 1% 100mW TCR200; Manufacturer_Part_Number: CR0603-F/-1R00ELF; Manufacturer_Name: Bourns; Part Reference: R20; Height: 0.55 mm; Datasheet Link: https://www.bourns.com/pdfs/chpreztr.pdf; Mouser Price/Stock: https://www.mouser.co.uk/ProductDetail/Bourns/CR0603-F-1R00ELF?qs=W%2FMpXkg%252BdQ7nBNmKZ%2F9sTA%3D%3D; Mouser Part Number: 652-CR0603-F/1R00ELF; Value: 36K; PCB Footprint: RESC1608X55N
R21 = CR0603-F_-1R00ELF: Thick Film Resistors - SMD Res 0603 1R0 1% 100mW TCR200; Manufacturer_Part_Number: CR0603-F/-1R00ELF; Manufacturer_Name: Bourns; Part Reference: R21; Height: 0.55 mm; Datasheet Link: https://www.bourns.com/pdfs/chpreztr.pdf; Mouser Price/Stock: https://www.mouser.co.uk/ProductDetail/Bourns/CR0603-F-1R00ELF?qs=W%2FMpXkg%252BdQ7nBNmKZ%2F9sTA%3D%3D; Mouser Part Number: 652-CR0603-F/1R00ELF; Value: 10K; PCB Footprint: RESC1608X55N
R22 = CR0603-F_-1R00ELF: Thick Film Resistors - SMD Res 0603 1R0 1% 100mW TCR200; Manufacturer_Part_Number: CR0603-F/-1R00ELF; Manufacturer_Name: Bourns; Part Reference: R22; Height: 0.55 mm; Datasheet Link: https://www.bourns.com/pdfs/chpreztr.pdf; Mouser Price/Stock: https://www.mouser.co.uk/ProductDetail/Bourns/CR0603-F-1R00ELF?qs=W%2FMpXkg%252BdQ7nBNmKZ%2F9sTA%3D%3D; Mouser Part Number: 652-CR0603-F/1R00ELF; Value: 10K; PCB Footprint: RESC1608X55N
R23 = CR0603-F_-1R00ELF: Thick Film Resistors - SMD Res 0603 1R0 1% 100mW TCR200; Manufacturer_Part_Number: CR0603-F/-1R00ELF; Manufacturer_Name: Bourns; Part Reference: R23; Height: 0.55 mm; Datasheet Link: https://www.bourns.com/pdfs/chpreztr.pdf; Mouser Price/Stock: https://www.mouser.co.uk/ProductDetail/Bourns/CR0603-F-1R00ELF?qs=W%2FMpXkg%252BdQ7nBNmKZ%2F9sTA%3D%3D; Mouser Part Number: 652-CR0603-F/1R00ELF; Value: 100; PCB Footprint: RESC1608X55N
R24 = CR0603-F_-1R00ELF: Thick Film Resistors - SMD Res 0603 1R0 1% 100mW TCR200; Manufacturer_Part_Number: CR0603-F/-1R00ELF; Manufacturer_Name: Bourns; Part Reference: R24; Height: 0.55 mm; Datasheet Link: https://www.bourns.com/pdfs/chpreztr.pdf; Mouser Price/Stock: https://www.mouser.co.uk/ProductDetail/Bourns/CR0603-F-1R00ELF?qs=W%2FMpXkg%252BdQ7nBNmKZ%2F9sTA%3D%3D; Mouser Part Number: 652-CR0603-F/1R00ELF; Value: 10K; PCB Footprint: RESC1608X55N
R25 = CR0603-F_-1R00ELF: Thick Film Resistors - SMD Res 0603 1R0 1% 100mW TCR200; Manufacturer_Part_Number: CR0603-F/-1R00ELF; Manufacturer_Name: Bourns; Part Reference: R25; Height: 0.55 mm; Datasheet Link: https://www.bourns.com/pdfs/chpreztr.pdf; Mouser Price/Stock: https://www.mouser.co.uk/ProductDetail/Bourns/CR0603-F-1R00ELF?qs=W%2FMpXkg%252BdQ7nBNmKZ%2F9sTA%3D%3D; Mouser Part Number: 652-CR0603-F/1R00ELF; Value: 1K; PCB Footprint: RESC1608X55N
R26 = CR0603-F_-1R00ELF: Thick Film Resistors - SMD Res 0603 1R0 1% 100mW TCR200; Manufacturer_Part_Number: CR0603-F/-1R00ELF; Manufacturer_Name: Bourns; Part Reference: R26; Height: 0.55 mm; Datasheet Link: https://www.bourns.com/pdfs/chpreztr.pdf; Mouser Price/Stock: https://www.mouser.co.uk/ProductDetail/Bourns/CR0603-F-1R00ELF?qs=W%2FMpXkg%252BdQ7nBNmKZ%2F9sTA%3D%3D; Mouser Part Number: 652-CR0603-F/1R00ELF; Value: 1K; PCB Footprint: RESC1608X55N
Y1 = ABS07-32.768KHZ-T: 32.768 kHz +/-20ppm Crystal 7pF 70 kOhms 2-SMD, No Lead; Manufacturer_Name: ABRACON; Part Reference: Y1; Height: 0.9 mm; Datasheet Link: https://abracon.com/Resonators/ABS07.pdf; Manufacturer_Part_Number: ABS07-32.768KHZ-T; Mouser Price/Stock: https://www.mouser.co.uk/ProductDetail/ABRACON/ABS07-32.768KHZ-T?qs=3SpAxaLJ01g8GJWeO3sA3Q%3D%3D; Mouser Part Number: 815-ABS07-32.768KHZT; Value: ABS07-32; PCB Footprint: ABS07
* = TitleBlock0: Page Create Date: March  8, 1995; Page Size: A; Page Count: 1; Page Modify Date: =ModifiedDate